# Altium schematic sheet debugprobe2.SchDoc
size A4
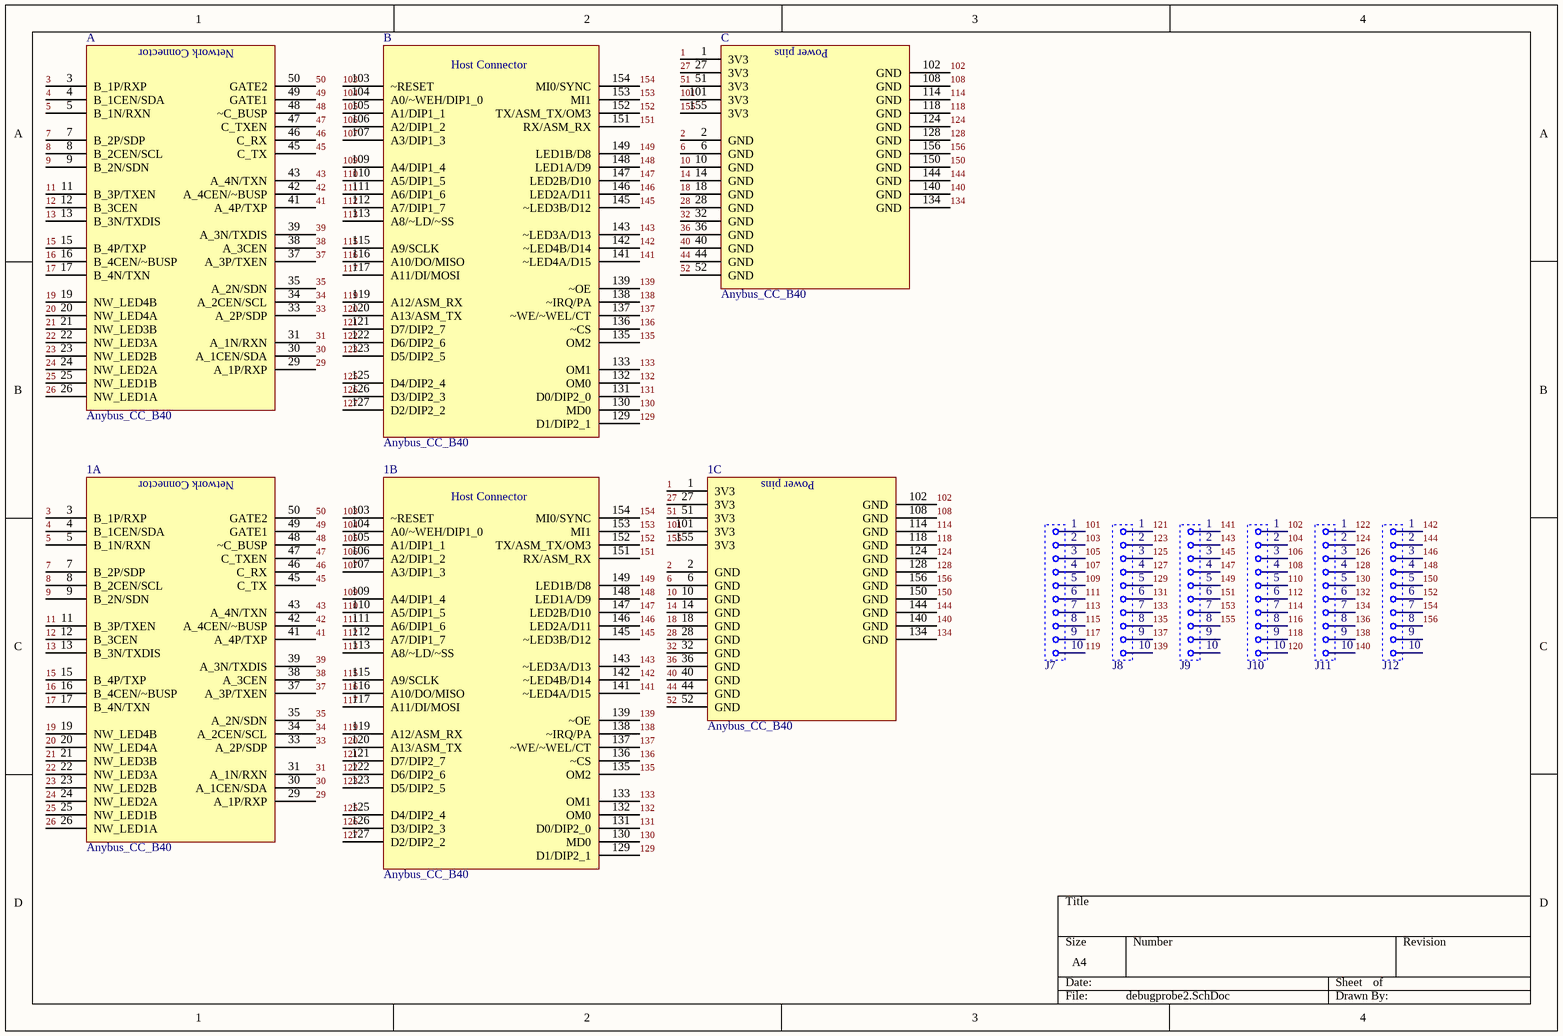
[diagram p0: debugprobe2.SchDoc]

## Parts
(Parts that share a designator on the sheet are numbered #1, #2 ... from top to bottom, then left to right.)
1  Anybus_CC_B40  [Anybus-CC-B40]  (parts A,B,C of 3)
?#1  Anybus_CC_B40  [Anybus-CC-B40]  (part A of 3)
?#2  Anybus_CC_B40  [Anybus-CC-B40]  (part B of 3)
?#3  Anybus_CC_B40  [Anybus-CC-B40]  (part C of 3)
J7  Header 10x1  [HEADER 10X1]  (value not drawn)
J8  Header 10x1  [HEADER 10X1]  (value not drawn)
J9  Header 10x1  [HEADER 10X1]  (value not drawn)
J10  Header 10x1  [HEADER 10X1]  (value not drawn)
J11  Header 10x1  [HEADER 10X1]  (value not drawn)
J12  Header 10x1  [HEADER 10X1]  (value not drawn)

## Nets
1: 1.1(3V3) ?#3.1(3V3)
2: 1.2(GND) ?#3.2(GND)
3: 1.3(B_1P/RXP) ?#1.3(B_1P/RXP)
4: 1.4(B_1CEN/SDA) ?#1.4(B_1CEN/SDA)
5: 1.5(B_1N/RXN) ?#1.5(B_1N/RXN)
6: 1.6(GND) ?#3.6(GND)
7: 1.7(B_2P/SDP) ?#1.7(B_2P/SDP)
8: 1.8(B_2CEN/SCL) ?#1.8(B_2CEN/SCL)
9: 1.9(B_2N/SDN) ?#1.9(B_2N/SDN)
10: 1.10(GND) ?#3.10(GND)
11: 1.11(B_3P/TXEN) ?#1.11(B_3P/TXEN)
12: 1.12(B_3CEN) ?#1.12(B_3CEN)
13: 1.13(B_3N/TXDIS) ?#1.13(B_3N/TXDIS)
14: 1.14(GND) ?#3.14(GND)
15: 1.15(B_4P/TXP) ?#1.15(B_4P/TXP)
16: 1.16(B_4CEN/~BUSP) ?#1.16(B_4CEN/~BUSP)
17: 1.17(B_4N/TXN) ?#1.17(B_4N/TXN)
18: 1.18(GND) ?#3.18(GND)
19: 1.19(NW_LED4B) ?#1.19(NW_LED4B)
20: 1.20(NW_LED4A) ?#1.20(NW_LED4A)
21: 1.21(NW_LED3B) ?#1.21(NW_LED3B)
22: 1.22(NW_LED3A) ?#1.22(NW_LED3A)
23: 1.23(NW_LED2B) ?#1.23(NW_LED2B)
24: 1.24(NW_LED2A) ?#1.24(NW_LED2A)
25: 1.25(NW_LED1B) ?#1.25(NW_LED1B)
26: 1.26(NW_LED1A) ?#1.26(NW_LED1A)
27: 1.27(3V3) ?#3.27(3V3)
28: 1.28(GND) ?#3.28(GND)
29: 1.29(A_1P/RXP) ?#1.29(A_1P/RXP)
30: 1.30(A_1CEN/SDA) ?#1.30(A_1CEN/SDA)
31: 1.31(A_1N/RXN) ?#1.31(A_1N/RXN)
32: 1.32(GND) ?#3.32(GND)
33: 1.33(A_2P/SDP) ?#1.33(A_2P/SDP)
34: 1.34(A_2CEN/SCL) ?#1.34(A_2CEN/SCL)
35: 1.35(A_2N/SDN) ?#1.35(A_2N/SDN)
36: 1.36(GND) ?#3.36(GND)
37: 1.37(A_3P/TXEN) ?#1.37(A_3P/TXEN)
38: 1.38(A_3CEN) ?#1.38(A_3CEN)
39: 1.39(A_3N/TXDIS) ?#1.39(A_3N/TXDIS)
40: 1.40(GND) ?#3.40(GND)
41: 1.41(A_4P/TXP) ?#1.41(A_4P/TXP)
42: 1.42(A_4CEN/~BUSP) ?#1.42(A_4CEN/~BUSP)
43: 1.43(A_4N/TXN) ?#1.43(A_4N/TXN)
44: 1.44(GND) ?#3.44(GND)
45: 1.45(C_TX) ?#1.45(C_TX)
46: 1.46(C_RX) ?#1.46(C_RX)
47: 1.47(C_TXEN) ?#1.47(C_TXEN)
48: 1.48(~C_BUSP) ?#1.48(~C_BUSP)
49: 1.49(GATE1) ?#1.49(GATE1)
50: 1.50(GATE2) ?#1.50(GATE2)
51: 1.51(3V3) ?#3.51(3V3)
52: 1.52(GND) ?#3.52(GND)
101: 1.101(3V3) ?#3.101(3V3) J7.1
102: 1.102(GND) ?#3.102(GND) J10.1
103: 1.103(~RESET) ?#2.103(~RESET) J7.2
104: 1.104(A0/~WEH/DIP1_0) ?#2.104(A0/~WEH/DIP1_0) J10.2
105: 1.105(A1/DIP1_1) ?#2.105(A1/DIP1_1) J7.3
106: 1.106(A2/DIP1_2) ?#2.106(A2/DIP1_2) J10.3
107: 1.107(A3/DIP1_3) ?#2.107(A3/DIP1_3) J7.4
108: 1.108(GND) ?#3.108(GND) J10.4
109: 1.109(A4/DIP1_4) ?#2.109(A4/DIP1_4) J7.5
110: 1.110(A5/DIP1_5) ?#2.110(A5/DIP1_5) J10.5
111: 1.111(A6/DIP1_6) ?#2.111(A6/DIP1_6) J7.6
112: 1.112(A7/DIP1_7) ?#2.112(A7/DIP1_7) J10.6
113: 1.113(A8/~LD/~SS) ?#2.113(A8/~LD/~SS) J7.7
114: 1.114(GND) ?#3.114(GND) J10.7
115: 1.115(A9/SCLK) ?#2.115(A9/SCLK) J7.8
116: 1.116(A10/DO/MISO) ?#2.116(A10/DO/MISO) J10.8
117: 1.117(A11/DI/MOSI) ?#2.117(A11/DI/MOSI) J7.9
118: 1.118(GND) ?#3.118(GND) J10.9
119: 1.119(A12/ASM_RX) ?#2.119(A12/ASM_RX) J7.10
120: 1.120(A13/ASM_TX) ?#2.120(A13/ASM_TX) J10.10
121: 1.121(D7/DIP2_7) ?#2.121(D7/DIP2_7) J8.1
122: 1.122(D6/DIP2_6) ?#2.122(D6/DIP2_6) J11.1
123: 1.123(D5/DIP2_5) ?#2.123(D5/DIP2_5) J8.2
124: 1.124(GND) ?#3.124(GND) J11.2
125: 1.125(D4/DIP2_4) ?#2.125(D4/DIP2_4) J8.3
126: 1.126(D3/DIP2_3) ?#2.126(D3/DIP2_3) J11.3
127: 1.127(D2/DIP2_2) ?#2.127(D2/DIP2_2) J8.4
128: 1.128(GND) ?#3.128(GND) J11.4
129: 1.129(D1/DIP2_1) ?#2.129(D1/DIP2_1) J8.5
130: 1.130(MD0) ?#2.130(MD0) J11.5
131: 1.131(D0/DIP2_0) ?#2.131(D0/DIP2_0) J8.6
132: 1.132(OM0) ?#2.132(OM0) J11.6
133: 1.133(OM1) ?#2.133(OM1) J8.7
134: 1.134(GND) ?#3.134(GND) J11.7
135: 1.135(OM2) ?#2.135(OM2) J8.8
136: 1.136(~CS) ?#2.136(~CS) J11.8
137: 1.137(~WE/~WEL/CT) ?#2.137(~WE/~WEL/CT) J8.9
138: 1.138(~IRQ/PA) ?#2.138(~IRQ/PA) J11.9
139: 1.139(~OE) ?#2.139(~OE) J8.10
140: 1.140(GND) ?#3.140(GND) J11.10
141: 1.141(~LED4A/D15) ?#2.141(~LED4A/D15) J9.1
142: 1.142(~LED4B/D14) ?#2.142(~LED4B/D14) J12.1
143: 1.143(~LED3A/D13) ?#2.143(~LED3A/D13) J9.2
144: 1.144(GND) ?#3.144(GND) J12.2
145: 1.145(~LED3B/D12) ?#2.145(~LED3B/D12) J9.3
146: 1.146(LED2A/D11) ?#2.146(LED2A/D11) J12.3
147: 1.147(LED2B/D10) ?#2.147(LED2B/D10) J9.4
148: 1.148(LED1A/D9) ?#2.148(LED1A/D9) J12.4
149: 1.149(LED1B/D8) ?#2.149(LED1B/D8) J9.5
150: 1.150(GND) ?#3.150(GND) J12.5
151: 1.151(RX/ASM_RX) ?#2.151(RX/ASM_RX) J9.6
152: 1.152(TX/ASM_TX/OM3) ?#2.152(TX/ASM_TX/OM3) J12.6
153: 1.153(MI1) ?#2.153(MI1) J9.7
154: 1.154(MI0/SYNC) ?#2.154(MI0/SYNC) J12.7
155: 1.155(3V3) ?#3.155(3V3) J9.8
156: 1.156(GND) ?#3.156(GND) J12.8

Not connected (* = marked no-connect by the designer): J9 9 10; J12 9 10

## Notes on the sheet
- (in symbol Anybus_CC_B40, part A) Network Connector
- (in symbol Anybus_CC_B40, part B) Host Connector
- (in symbol Anybus_CC_B40, part C) Power pins